# Altium schematic sheet ADCs.SchDoc: FIT_PM12 board
size 420 x 297 mm; CheckedBy: G.Kasprowicz; Author: INR Moscow; CompanyName: WUT ISE; DrawnBy: M.Podgórski; Organization: WUT ISE; Address1: PW ISE; Address2: Nowowiejska 15/19 00-665 Warsaw; Address3: gkasprow@gmail.com; DocumentNumber: 4; Revision: 2; SheetNumber: 6; SheetTotal: 21; ModifiedBy: -; CheckedDate: -; Title2: ADCs; DivGrp: WUT ISE; Designer: INR RAS; ModifiedDate: -; ProjectName: Sensor Box
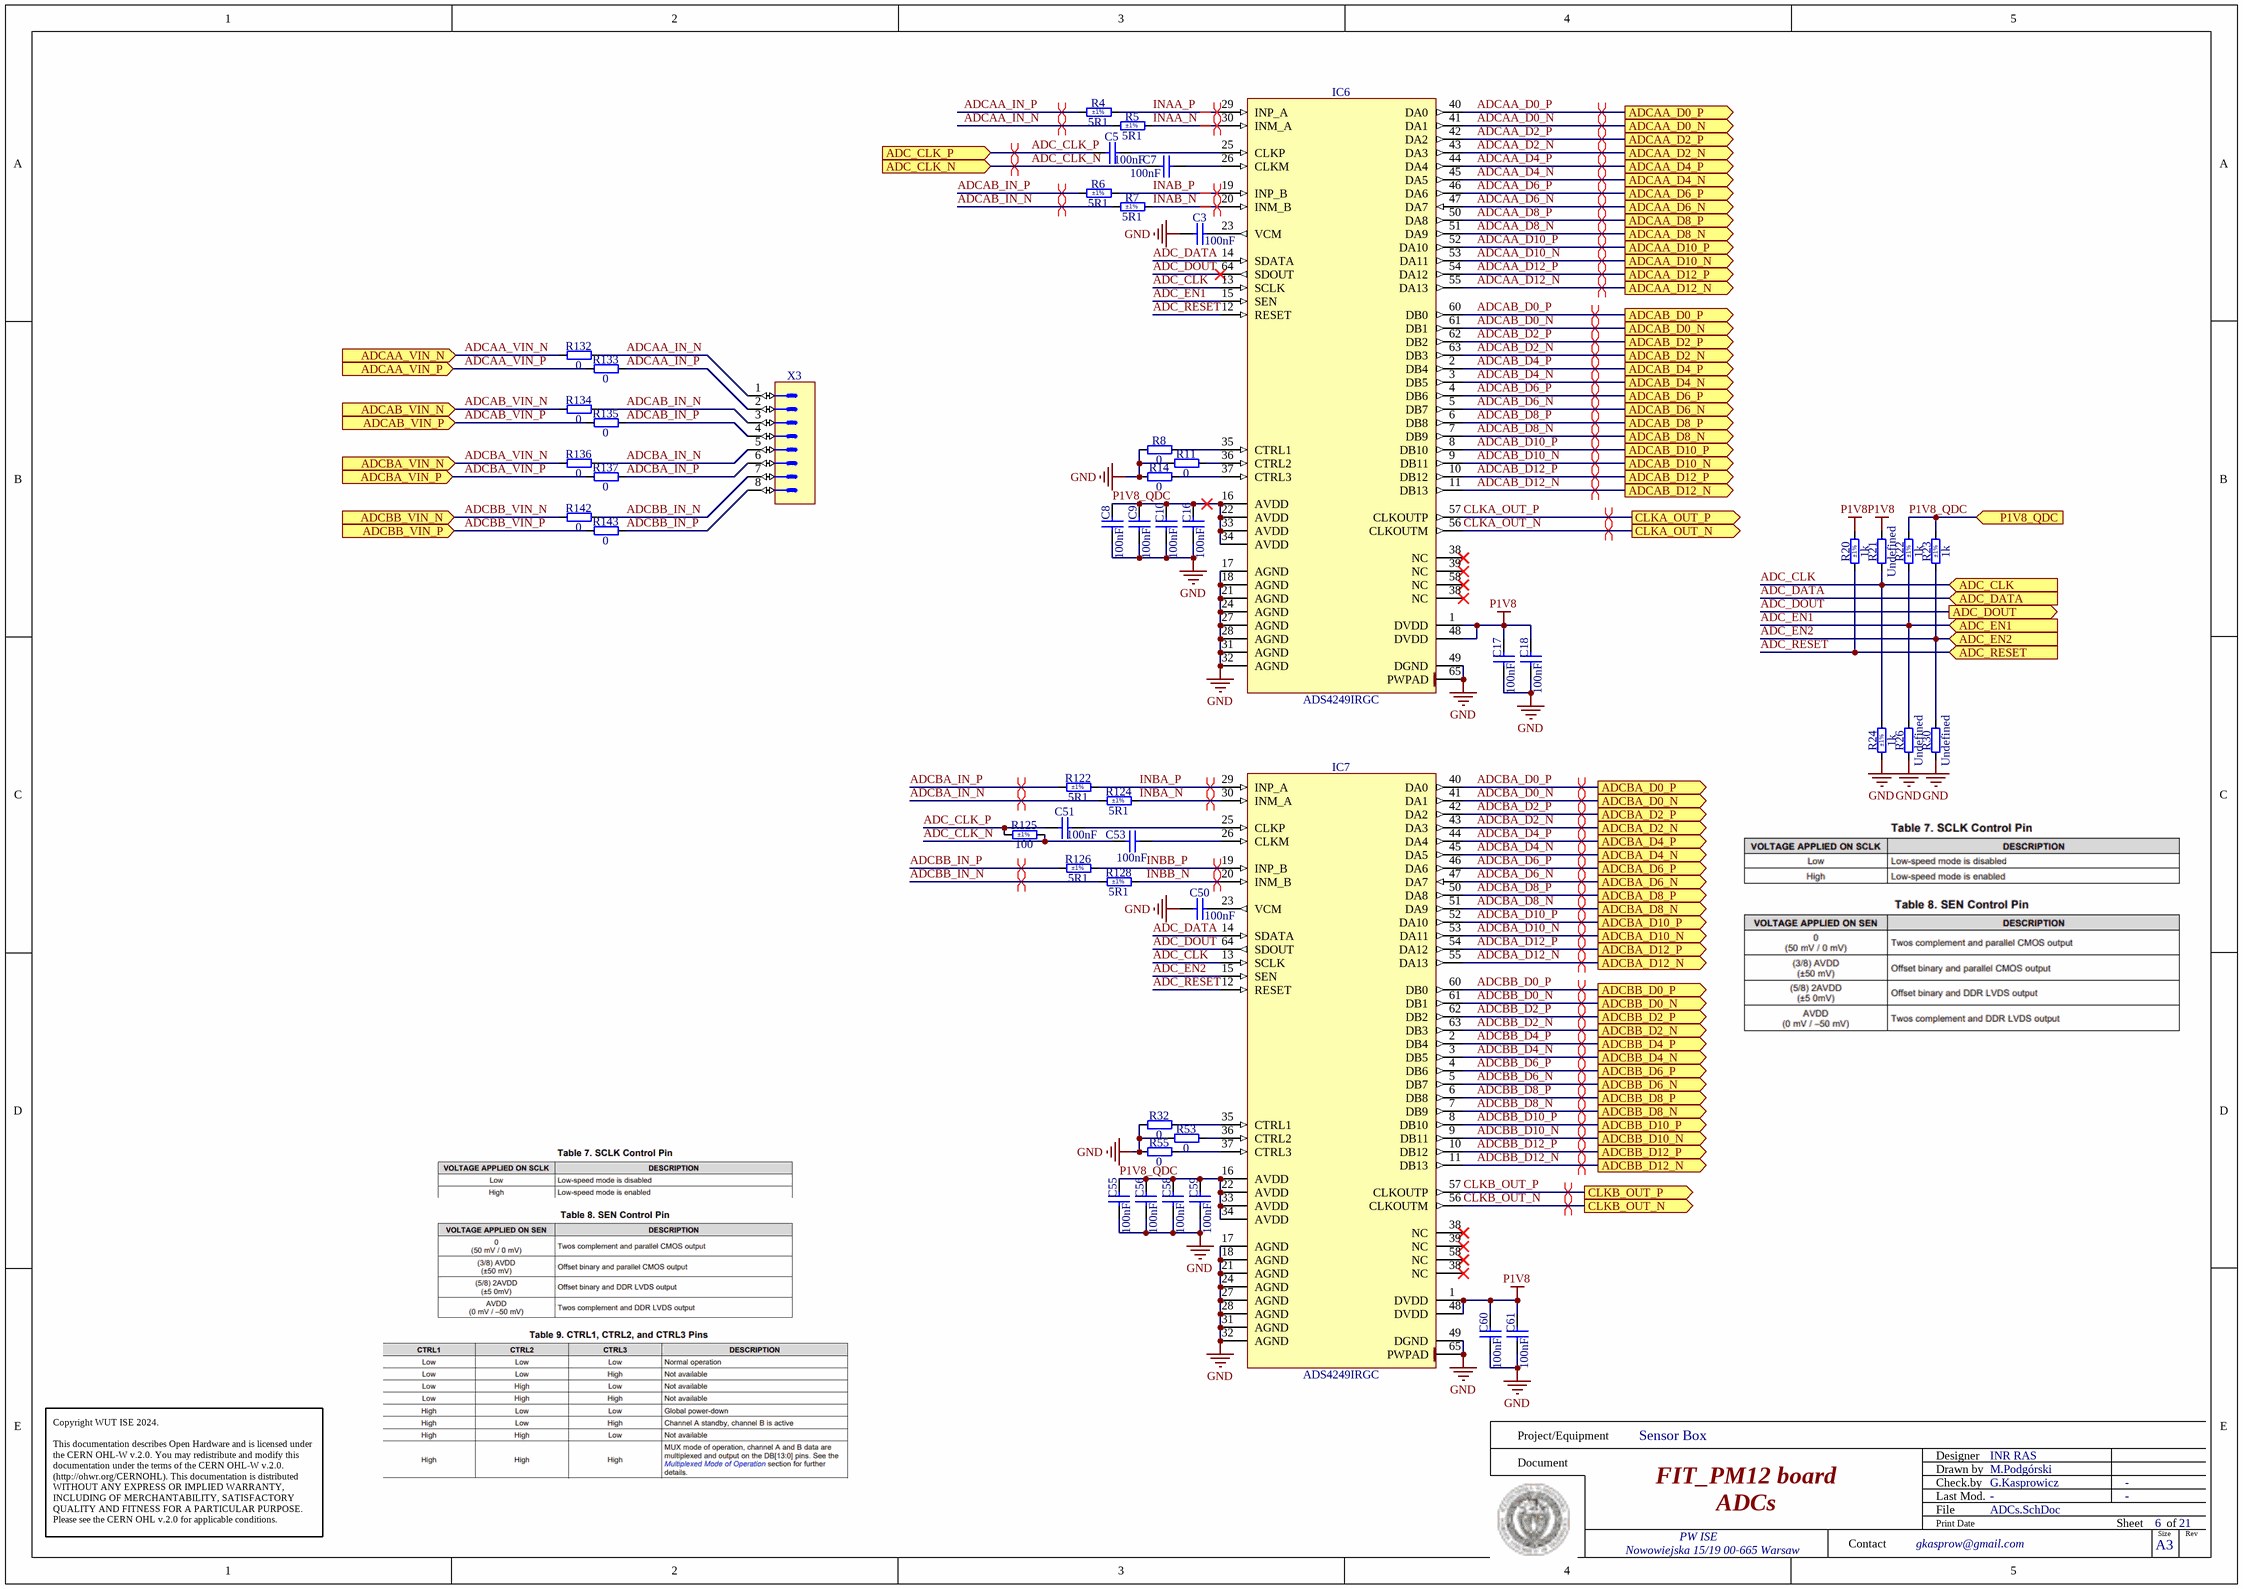
[diagram p0: ADCs.SchDoc]

## Parts
C3  100nF  [CAPC1005X55N]
C5  100nF  [CAPC1005X55N]
C7  100nF  [CAPC1005X55N]
C8  100nF  [CAPC1005X55N]
C9  100nF  [CAPC1005X55N]
C10  100nF  [CAPC1005X55N]
C16  100nF  [CAPC1005X55N]
C17  100nF  [CAPC1005X55N]
C18  100nF  [CAPC1005X55N]
C50  100nF  [CAPC1005X55N]
C51  100nF  [CAPC1005X55N]
C53  100nF  [CAPC1005X55N]
C55  100nF  [CAPC1005X55N]
C56  100nF  [CAPC1005X55N]
C58  100nF  [CAPC1005X55N]
C59  100nF  [CAPC1005X55N]
C60  100nF  [CAPC1005X55N]
C61  100nF  [CAPC1005X55N]
IC6  ADS4249IRGC  [QFN50P900X900X100-65N-S750]
IC7  ADS4249IRGC  [QFN50P900X900X100-65N-S750]
R4  5R1  Tolerance: ±1%  [RESC1005X40N]
R5  5R1  Tolerance: ±1%  [RESC1005X40N]
R6  5R1  Tolerance: ±1%  [RESC1005X40N]
R7  5R1  Tolerance: ±1%  [RESC1005X40N]
R8  0  [RESC1005X40N]
R11  0  [RESC1005X40N]
R14  0  [RESC1005X40N]
R20  1k  Tolerance: ±1%  [RESC1005X40N]
R21  Undefined  [RESC1005X40N]
R22  1k  Tolerance: ±1%  [RESC1005X40N]
R23  1k  Tolerance: ±1%  [RESC1005X40N]
R24  1k  Tolerance: ±1%  [RESC1005X40N]
R26  Undefined  [RESC1005X40N]
R30  Undefined  [RESC1005X40N]
R32  0  [RESC1005X40N]
R53  0  [RESC1005X40N]
R55  0  [RESC1005X40N]
R122  5R1  Tolerance: ±1%  [RESC1005X40N]
R124  5R1  Tolerance: ±1%  [RESC1005X40N]
R125  100  Tolerance: ±1%  [RESC1608X55N]
R126  5R1  Tolerance: ±1%  [RESC1005X40N]
R128  5R1  Tolerance: ±1%  [RESC1005X40N]
R132  0  [RESC1005X40N]
R133  0  [RESC1005X40N]
R134  0  [RESC1005X40N]
R135  0  [RESC1005X40N]
R136  0  [RESC1005X40N]
R137  0  [RESC1005X40N]
R142  0  [RESC1005X40N]
R143  0  [RESC1005X40N]
X3  Header 8  [SAMTEC_DW-08-09-L-S-470]  (value not drawn)

## Ports
ADC_CLK (in), ADC_CLK_N (in), ADC_CLK_P (in), ADC_DATA (in), ADC_DOUT (out), ADC_EN1 (in), ADC_EN2 (in), ADC_RESET (in), ADCAA_D0_N (out), ADCAA_D0_P (out), ADCAA_D2_N (out), ADCAA_D2_P (out), ADCAA_D4_N (out), ADCAA_D4_P (out), ADCAA_D6_N (out), ADCAA_D6_P (out), ADCAA_D8_N (out), ADCAA_D8_P (out), ADCAA_D10_N (out), ADCAA_D10_P (out), ADCAA_D12_N (out), ADCAA_D12_P (out), ADCAA_VIN_N (in), ADCAA_VIN_P (in), ADCAB_D0_N (out), ADCAB_D0_P (out), ADCAB_D2_N (out), ADCAB_D2_P (out), ADCAB_D4_N (out), ADCAB_D4_P (out), ADCAB_D6_N (out), ADCAB_D6_P (out), ADCAB_D8_N (out), ADCAB_D8_P (out), ADCAB_D10_N (out), ADCAB_D10_P (out), ADCAB_D12_N (out), ADCAB_D12_P (out), ADCAB_VIN_N (in), ADCAB_VIN_P (in), ADCBA_D0_N (out), ADCBA_D0_P (out), ADCBA_D2_N (out), ADCBA_D2_P (out), ADCBA_D4_N (out), ADCBA_D4_P (out), ADCBA_D6_N (out), ADCBA_D6_P (out), ADCBA_D8_N (out), ADCBA_D8_P (out), ADCBA_D10_N (out), ADCBA_D10_P (out), ADCBA_D12_N (out), ADCBA_D12_P (out), ADCBA_VIN_N (in), ADCBA_VIN_P (in), ADCBB_D0_N (out), ADCBB_D0_P (out), ADCBB_D2_N (out), ADCBB_D2_P (out), ADCBB_D4_N (out), ADCBB_D4_P (out), ADCBB_D6_N (out), ADCBB_D6_P (out), ADCBB_D8_N (out), ADCBB_D8_P (out), ADCBB_D10_N (out), ADCBB_D10_P (out), ADCBB_D12_N (out), ADCBB_D12_P (out), ADCBB_VIN_N (in), ADCBB_VIN_P (in), CLKA_OUT_N (out), CLKA_OUT_P (out), CLKB_OUT_N (out), CLKB_OUT_P (out), P1V8_QDC (in)

## Nets
GND: C3.1 C8.1 C9.1 C10.1 C16.1 C17.1 C18.1 C50.1 C55.1 C56.1 C58.1 C59.1 C60.1 C61.1 IC6.17(AGND) IC6.18(AGND) IC6.21(AGND) IC6.24(AGND) IC6.27(AGND) IC6.28(AGND) IC6.31(AGND) IC6.32(AGND) IC6.49(DGND) IC6.65(PWPAD) IC7.17(AGND) IC7.18(AGND) IC7.21(AGND) IC7.24(AGND) IC7.27(AGND) IC7.28(AGND) IC7.31(AGND) IC7.32(AGND) IC7.49(DGND) IC7.65(PWPAD) R8.1 R11.1 R14.1 R24.1 R26.1 R30.1 R32.1 R53.1 R55.1
P1V8: C17.2 C18.2 C60.2 C61.2 IC6.1(DVDD) IC6.48(DVDD) IC7.1(DVDD) IC7.48(DVDD) R20.2 R21.2
ADC_CLK: IC6.13(SCLK) IC7.13(SCLK) R21.1 R24.2 ; port ADC_CLK
ADC_CLK_N: C7.1 C53.1 R125.2 ; port ADC_CLK_N
ADC_CLK_P: C5.1 C51.1 R125.1 ; port ADC_CLK_P
ADC_DATA: IC6.14(SDATA) IC7.14(SDATA) ; port ADC_DATA
ADC_DOUT: IC6.64(SDOUT) IC7.64(SDOUT) ; port ADC_DOUT
ADC_EN1: IC6.15(SEN) R22.1 R26.2 ; port ADC_EN1
ADC_EN2: IC7.15(SEN) R23.1 R30.2 ; port ADC_EN2
ADC_RESET: IC6.12(RESET) IC7.12(RESET) R20.1 ; port ADC_RESET
ADCAA_D0_N: IC6.41(DA1) ; port ADCAA_D0_N
ADCAA_D0_P: IC6.40(DA0) ; port ADCAA_D0_P
ADCAA_D2_N: IC6.43(DA3) ; port ADCAA_D2_N
ADCAA_D2_P: IC6.42(DA2) ; port ADCAA_D2_P
ADCAA_D4_N: IC6.45(DA5) ; port ADCAA_D4_N
ADCAA_D4_P: IC6.44(DA4) ; port ADCAA_D4_P
ADCAA_D6_N: IC6.47(DA7) ; port ADCAA_D6_N
ADCAA_D6_P: IC6.46(DA6) ; port ADCAA_D6_P
ADCAA_D8_N: IC6.51(DA9) ; port ADCAA_D8_N
ADCAA_D8_P: IC6.50(DA8) ; port ADCAA_D8_P
ADCAA_D10_N: IC6.53(DA11) ; port ADCAA_D10_N
ADCAA_D10_P: IC6.52(DA10) ; port ADCAA_D10_P
ADCAA_D12_N: IC6.55(DA13) ; port ADCAA_D12_N
ADCAA_D12_P: IC6.54(DA12) ; port ADCAA_D12_P
ADCAA_IN_N: R5.1 R132.2 X3.1
ADCAA_IN_P: R4.1 R133.2 X3.2
ADCAA_VIN_N: R132.1 ; port ADCAA_VIN_N
ADCAA_VIN_P: R133.1 ; port ADCAA_VIN_P
ADCAB_D0_N: IC6.61(DB1) ; port ADCAB_D0_N
ADCAB_D0_P: IC6.60(DB0) ; port ADCAB_D0_P
ADCAB_D2_N: IC6.63(DB3) ; port ADCAB_D2_N
ADCAB_D2_P: IC6.62(DB2) ; port ADCAB_D2_P
ADCAB_D4_N: IC6.3(DB5) ; port ADCAB_D4_N
ADCAB_D4_P: IC6.2(DB4) ; port ADCAB_D4_P
ADCAB_D6_N: IC6.5(DB7) ; port ADCAB_D6_N
ADCAB_D6_P: IC6.4(DB6) ; port ADCAB_D6_P
ADCAB_D8_N: IC6.7(DB9) ; port ADCAB_D8_N
ADCAB_D8_P: IC6.6(DB8) ; port ADCAB_D8_P
ADCAB_D10_N: IC6.9(DB11) ; port ADCAB_D10_N
ADCAB_D10_P: IC6.8(DB10) ; port ADCAB_D10_P
ADCAB_D12_N: IC6.11(DB13) ; port ADCAB_D12_N
ADCAB_D12_P: IC6.10(DB12) ; port ADCAB_D12_P
ADCAB_IN_N: R7.1 R134.2 X3.3
ADCAB_IN_P: R6.1 R135.2 X3.4
ADCAB_VIN_N: R134.1 ; port ADCAB_VIN_N
ADCAB_VIN_P: R135.1 ; port ADCAB_VIN_P
ADCBA_D0_N: IC7.41(DA1) ; port ADCBA_D0_N
ADCBA_D0_P: IC7.40(DA0) ; port ADCBA_D0_P
ADCBA_D2_N: IC7.43(DA3) ; port ADCBA_D2_N
ADCBA_D2_P: IC7.42(DA2) ; port ADCBA_D2_P
ADCBA_D4_N: IC7.45(DA5) ; port ADCBA_D4_N
ADCBA_D4_P: IC7.44(DA4) ; port ADCBA_D4_P
ADCBA_D6_N: IC7.47(DA7) ; port ADCBA_D6_N
ADCBA_D6_P: IC7.46(DA6) ; port ADCBA_D6_P
ADCBA_D8_N: IC7.51(DA9) ; port ADCBA_D8_N
ADCBA_D8_P: IC7.50(DA8) ; port ADCBA_D8_P
ADCBA_D10_N: IC7.53(DA11) ; port ADCBA_D10_N
ADCBA_D10_P: IC7.52(DA10) ; port ADCBA_D10_P
ADCBA_D12_N: IC7.55(DA13) ; port ADCBA_D12_N
ADCBA_D12_P: IC7.54(DA12) ; port ADCBA_D12_P
ADCBA_IN_N: R124.1 R136.2 X3.5
ADCBA_IN_P: R122.1 R137.2 X3.6
ADCBA_VIN_N: R136.1 ; port ADCBA_VIN_N
ADCBA_VIN_P: R137.1 ; port ADCBA_VIN_P
ADCBB_D0_N: IC7.61(DB1) ; port ADCBB_D0_N
ADCBB_D0_P: IC7.60(DB0) ; port ADCBB_D0_P
ADCBB_D2_N: IC7.63(DB3) ; port ADCBB_D2_N
ADCBB_D2_P: IC7.62(DB2) ; port ADCBB_D2_P
ADCBB_D4_N: IC7.3(DB5) ; port ADCBB_D4_N
ADCBB_D4_P: IC7.2(DB4) ; port ADCBB_D4_P
ADCBB_D6_N: IC7.5(DB7) ; port ADCBB_D6_N
ADCBB_D6_P: IC7.4(DB6) ; port ADCBB_D6_P
ADCBB_D8_N: IC7.7(DB9) ; port ADCBB_D8_N
ADCBB_D8_P: IC7.6(DB8) ; port ADCBB_D8_P
ADCBB_D10_N: IC7.9(DB11) ; port ADCBB_D10_N
ADCBB_D10_P: IC7.8(DB10) ; port ADCBB_D10_P
ADCBB_D12_N: IC7.11(DB13) ; port ADCBB_D12_N
ADCBB_D12_P: IC7.10(DB12) ; port ADCBB_D12_P
ADCBB_IN_N: R128.1 R142.2 X3.7
ADCBB_IN_P: R126.1 R143.2 X3.8
ADCBB_VIN_N: R142.1 ; port ADCBB_VIN_N
ADCBB_VIN_P: R143.1 ; port ADCBB_VIN_P
CLKA_OUT_N: IC6.56(CLKOUTM) ; port CLKA_OUT_N
CLKA_OUT_P: IC6.57(CLKOUTP) ; port CLKA_OUT_P
CLKB_OUT_N: IC7.56(CLKOUTM) ; port CLKB_OUT_N
CLKB_OUT_P: IC7.57(CLKOUTP) ; port CLKB_OUT_P
INAA_N: IC6.30(INM_A) R5.2
INAA_P: IC6.29(INP_A) R4.2
INAB_N: IC6.20(INM_B) R7.2
INAB_P: IC6.19(INP_B) R6.2
INBA_N: IC7.30(INM_A) R124.2
INBA_P: IC7.29(INP_A) R122.2
INBB_N: IC7.20(INM_B) R128.2
INBB_P: IC7.19(INP_B) R126.2
P1V8_QDC: C8.2 C9.2 C10.2 C16.2 C55.2 C56.2 C58.2 C59.2 IC6.16(AVDD) IC6.22(AVDD) IC6.33(AVDD) IC6.34(AVDD) IC7.16(AVDD) IC7.22(AVDD) IC7.33(AVDD) IC7.34(AVDD) R22.2 R23.2 ; port P1V8_QDC
NetC3_2: C3.2 IC6.23(VCM)
NetC5_2: C5.2 IC6.25(CLKP)
NetC7_2: C7.2 IC6.26(CLKM)
NetC50_2: C50.2 IC7.23(VCM)
NetC51_2: C51.2 IC7.25(CLKP)
NetC53_2: C53.2 IC7.26(CLKM)
NetIC6_35: IC6.35(CTRL1) R8.2
NetIC6_36: IC6.36(CTRL2) R11.2
NetIC6_37: IC6.37(CTRL3) R14.2
NetIC7_35: IC7.35(CTRL1) R32.2
NetIC7_36: IC7.36(CTRL2) R53.2
NetIC7_37: IC7.37(CTRL3) R55.2

Not connected (* = marked no-connect by the designer): IC6 38(NC)* 39(NC)* 58(NC)*; IC7 38(NC)* 39(NC)* 58(NC)*

## Layout directives
differential pair; differential pair class D100: ADC_CLK_N, ADC_CLK_P, ADCAA_D0_N, ADCAA_D0_P, ADCAA_D2_N, ADCAA_D2_P, ADCAA_D4_N, ADCAA_D4_P, ADCAA_D6_N, ADCAA_D6_P, ADCAA_D8_N, ADCAA_D8_P, ADCAA_D10_N, ADCAA_D10_P, ADCAA_D12_N, ADCAA_D12_P, ADCAA_IN_N, ADCAA_IN_P, ADCAB_D0_N, ADCAB_D0_P, ADCAB_D2_N, ADCAB_D2_P, ADCAB_D4_N, ADCAB_D4_P, ADCAB_D6_N, ADCAB_D6_P, ADCAB_D8_N, ADCAB_D8_P, ADCAB_D10_N, ADCAB_D10_P, ADCAB_D12_N, ADCAB_D12_P, ADCAB_IN_N, ADCAB_IN_P, ADCBA_D0_N, ADCBA_D0_P, ADCBA_D2_N, ADCBA_D2_P, ADCBA_D4_N, ADCBA_D4_P, ADCBA_D6_N, ADCBA_D6_P, ADCBA_D8_N, ADCBA_D8_P, ADCBA_D10_N, ADCBA_D10_P, ADCBA_D12_N, ADCBA_D12_P, ADCBA_IN_N, ADCBA_IN_P, ADCBB_D0_N, ADCBB_D0_P, ADCBB_D2_N, ADCBB_D2_P, ADCBB_D4_N, ADCBB_D4_P, ADCBB_D6_N, ADCBB_D6_P, ADCBB_D8_N, ADCBB_D8_P, ADCBB_D10_N, ADCBB_D10_P, ADCBB_D12_N, ADCBB_D12_P, ADCBB_IN_N, ADCBB_IN_P, CLKA_OUT_N, CLKA_OUT_P, CLKB_OUT_N, CLKB_OUT_P, INAA_N, INAA_P, INAB_N, INAB_P, INBA_N, INBA_P, INBB_N, INBB_P

## Notes on the sheet
- Project/Equipment
- Document
- Designer
- Drawn by
- Check.by
- Copyright WUT ISE 2024.
  This documentation describes Open Hardware and is licensed under the CERN OHL-W v.2.0. You may redistribute and modify this documentation under the terms of the CERN OHL-W v.2.0. (http://ohwr.org/CERNOHL). This documentation is distributed WITHOUT ANY EXPRESS OR IMPLIED WARRANTY, INCLUDING OF MERCHANTABILITY, SATISFACTORY QUALITY AND FITNESS FOR A PARTICULAR PURPOSE. Please see the CERN OHL v.2.0 for applicable conditions.
- Contact
- File
- Last Mod.
- Print Date
- Sheet
- Size
- A3
- of
- Rev

## Library data of the parts
C3 C5 C7-C10 C16-C18 C50 C51 C53 C55 C56 C58-C61 = CC0402_100NF_16V_10%_X5R: Non-polarised capacitor; Part Description: SMD Multilayer Chip Ceramic Capacitor; Manufacturer: GENERIC; Manufacturer1 Part Number: GRM155R61C104KA88D; Voltage: 16V; TC: X5R; Tolerance: ±10%; Part Number: CC0402_100NF_16V_10%_X5R; Component Kind: Standard; Component Type: Standard; Pin Count: 2; Value: 100nF; Status: None; Manufacturer Part Number: CC0402_100NF_16V_10%_X5R; Case: 0402; Mounted: Yes; Socket: No; SMD: Yes; Sense: No; Manufacturer1 Example: MURATA; Manufacturer1 ComponentHeight: 0.55mm; HelpURL: \\cern.ch\dfs\Applications\Altium\Datasheets\CC0402_X5R_MURATA_GRM.pdf; Author: CERN DEM JLC; CreateDate: 10.12.2013; LatestRevisionDate: 10.12.2013
IC6 IC7 = ADS4249IRGC: 16-Bit, 200-MSPS Analog-to-Digital Converters; Part Description: Dual-Channel, 14-Bit, 250-MSPS Ultralow-Power ADC; Manufacturer: TEXAS INSTRUMENTS; PressFit: No; Bonding: No; Part Number: ADS4249IRGC; Component Kind: Standard; Component Type: Standard; Device: ADS4249IRGC; PackageDescription: QFN, 0.50mm Pitch, Square; 64 Pin, 9.00mm L X 9.00mm W X 1.00mm H body (w/Thermal Tab 7.5 X 7.5mm), IPC Medium Density; Manufacturer Part Number: ADS4249IRGC; Pin Count: 65; Case: QFN64; Mounted: Yes; Socket: No; SMD: Yes; Sense: No; ComponentHeight: 1mm; Author: CERN DEM HF; HelpURL: \\cern.ch\dfs\Applications\Altium\Datasheets\ADS4249IRGC.pdf; CreateDate: 05.12.2024; LatestRevisionDate: 05.12.2024
R4-R7 R122 R124 R126 R128 = R0402_5R1_1%_0.0625W_100PPM: Resistor - 1%; Part Description: General Purpose Thick Film Chip Resistor; Manufacturer: GENERIC; Manufacturer1 Part Number: CRCW04025R10FK; TC: ±100ppm/°C; PressFit: No; Part Number: R0402_5R1_1%_0.0625W_100PPM; Component Kind: Standard; Component Type: Standard; Pin Count: 2; Value: 5R1; Status: Not Recommended; Power: 0.0625W; Manufacturer Part Number: R0402_5R1_1%_0.0625W_100PPM; Case: 0402; Mounted: Yes; Sense: No; Socket: No; SMD: Yes; Manufacturer1 Example: VISHAY; Manufacturer1 ComponentHeight: 0.4mm; HelpURL: \\cern.ch\dfs\Applications\Altium\Datasheets\R0402_VISHAY_CRCW e3.pdf; Author: CERN DEM MR; CreateDate: 22.11.2016; LatestRevisionDate: 22.11.2016
R8 R11 R14 R32 R53 R55 R132-R137 R142 R143 = R0402_0R_JUMPER: Resistor; Part Description: 1A (0.05R Max DC Resistance) Zero Ohm Jumper; Manufacturer: GENERIC; Manufacturer1 Part Number: 232270591001L; PressFit: No; Part Number: R0402_0R_JUMPER; Component Kind: Standard; Component Type: Standard; Pin Count: 2; Value: 0; Status: Not Recommended; Manufacturer Part Number: R0402_0R_JUMPER; Case: 0402; Mounted: Yes; Sense: No; Socket: No; SMD: Yes; Manufacturer1 Example: YAGEO PHYCOMP; Manufacturer1 ComponentHeight: 0.4mm; HelpURL: \\cern.ch\dfs\Applications\Altium\Datasheets\R0402_Phycomp_RC0402.pdf; Author: CERN DEM JLC; CreateDate: 03.12.2007; LatestRevisionDate: 17.10.2012
R20 R22-R24 = R0402_1K_1%_0.0625W_100PPM: Resistor - 1%; Part Description: General Purpose Thick Film Chip Resistor; Manufacturer: GENERIC; Manufacturer1 Part Number: 232270671002L; TC: ±100ppm/°C; PressFit: No; Part Number: R0402_1K_1%_0.0625W_100PPM; Component Kind: Standard; Component Type: Standard; Pin Count: 2; Value: 1k; Status: Not Recommended; Power: 0.0625W; Manufacturer Part Number: R0402_1K_1%_0.0625W_100PPM; Case: 0402; Mounted: Yes; Sense: No; Socket: No; SMD: Yes; Manufacturer1 Example: YAGEO PHYCOMP; Manufacturer1 ComponentHeight: 0.4mm; HelpURL: \\cern.ch\dfs\Applications\Altium\Datasheets\R0402_Phycomp_RC0402.pdf; Author: CERN DEM JLC; CreateDate: 03.12.2007; LatestRevisionDate: 17.10.2012
R21 R26 R30 = R0402_NO-VALUE: Resistor; Part Description: Reserved Footprint For a 0402 (1005) Chip Resistor; PressFit: No; Mounted: No; Part Number: R0402_NO-VALUE; Component Kind: Standard; Component Type: Standard; Pin Count: 2; Value: Undefined; Status: None; Manufacturer: Undefined; Manufacturer Part Number: R0402_NO-VALUE; Case: 0402; Sense: No; Socket: No; SMD: Yes; Manufacturer1 Example: Undefined; Manufacturer1 Part Number: Undefined; Manufacturer1 ComponentHeight: Undefined; HelpURL: Undefined; Author: CERN DEM JLC; CreateDate: 03.12.2007; LatestRevisionDate: 13.03.2008
R125 = R0603_100R_1%_0.1W_100PPM: Resistor - 1%; Part Description: General Purpose Thick Film Chip Resistor; Manufacturer: GENERIC; Manufacturer1 Part Number: NRC06F4700TRF; Power: 0.1W; TC: ±100ppm/°C; PressFit: No; Part Number: R0603_100R_1%_0.1W_100PPM; Component Kind: Standard; Component Type: Standard; Pin Count: 2; Value: 100; Status: Preferred; Manufacturer Part Number: R0603_100R_1%_0.1W_100PPM; Case: 0603; Mounted: Yes; Sense: No; Socket: No; SMD: Yes; Manufacturer1 Example: NIC COMPONENT; Manufacturer1 ComponentHeight: 0.55mm; HelpURL: \\cern.ch\dfs\Applications\Altium\Datasheets\R0603_NIC_NRC.pdf; Author: CERN DEM JLC; CreateDate: 03.12.2007; LatestRevisionDate: 13.03.2008
X3 = SAMTEC_DW-08-09-L-S-470: Connector 8 Male; Part Description: 8 Contacts, Pitch 2.54mm, Single Row Straight .Flex Stack, Flexible Board Stacker (Stacker Height = 11,938mm); Manufacturer: SAMTEC; PressFit: No; Part Number: SAMTEC_DW-08-09-L-S-470; Component Kind: Standard; Component Type: Standard; Pin Count: 8; Family: Header 8; Mounted: Yes; Socket: No; SMD: No; Sense: No; Status: None; Manufacturer Part Number: DW-08-09-L-S-470; ComponentHeight: 15.75mm; HelpURL: \\cern.ch\dfs\Applications\Altium\Datasheets\SAMTEC_DW.pdf; Author: CERN DEM HF; CreateDate: 06.06.2024; LatestRevisionDate: 06.06.2024